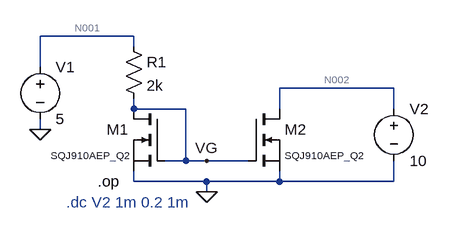
[diagram p0: schematic current_mirror.asc]
current_mirror.asc, the LTspice schematic file:
Version 4.1
SHEET 1 880 680
WIRE 112 16 -32 16
WIRE 112 32 112 16
WIRE -32 64 -32 16
WIRE 512 96 336 96
WIRE 112 128 112 112
WIRE 192 128 112 128
WIRE 336 128 336 96
WIRE 512 128 512 96
WIRE -32 160 -32 144
WIRE 192 208 192 128
WIRE 192 208 160 208
WIRE 224 208 192 208
WIRE 288 208 224 208
WIRE 112 240 112 224
WIRE 224 240 112 240
WIRE 336 240 336 224
WIRE 336 240 224 240
WIRE 512 240 512 208
WIRE 512 240 336 240
WIRE 224 256 224 240
FLAG 224 256 0
FLAG -32 160 0
FLAG 224 208 VG
SYMBOL nmos 160 128 M0
WINDOW 3 56 72 Left 1
SYMATTR InstName M1
SYMATTR Value SQJ910AEP_Q2
SYMBOL nmos 288 128 R0
WINDOW 3 56 72 Left 1
SYMATTR InstName M2
SYMATTR Value SQJ910AEP_Q2
SYMBOL res 96 16 R0
SYMATTR InstName R1
SYMATTR Value 2k
SYMBOL voltage -32 48 R0
WINDOW 123 0 0 Left 0
WINDOW 39 0 0 Left 0
SYMATTR InstName V1
SYMATTR Value 5
SYMBOL voltage 512 112 R0
WINDOW 123 0 0 Left 0
WINDOW 39 0 0 Left 0
SYMATTR InstName V2
SYMATTR Value 10
TEXT 56 240 Left 2 !.op
TEXT 8 272 Left 2 ;.dc V2 1m 0.2 1m

The netlist it stands for:
* current_mirror.asc
M1 VG VG 0 0 SQJ910AEP_Q2
M2 N002 VG 0 0 SQJ910AEP_Q2
R1 N001 VG 2k
V1 N001 0 5
V2 N002 0 10
.model NMOS NMOS
.model PMOS PMOS
.lib standard.mos
.op
* .dc V2 1m 0.2 1m
.backanno
.end

* Results of the author's LTspice run, read from the files saved beside the schematic
* Operating Point:
*   V(n002) = 10 V
*   V(vg) = 2.007 V
*   V(n001) = 5 V
*   Id(M1) = 1.497 mA
*   Ig(M1) = -649.9 pA
*   Is(M1) = -1.497 mA
*   I(R1) = 1.497 mA
*   I(V2) = -1.508 mA
*   I(V1) = -1.497 mA
*   Id(M2) = 1.508 mA
*   Ig(M2) = -143.6 pA
*   Is(M2) = -1.508 mA